# EAGLE schematic spi1.1 (EAGLE 6.1)
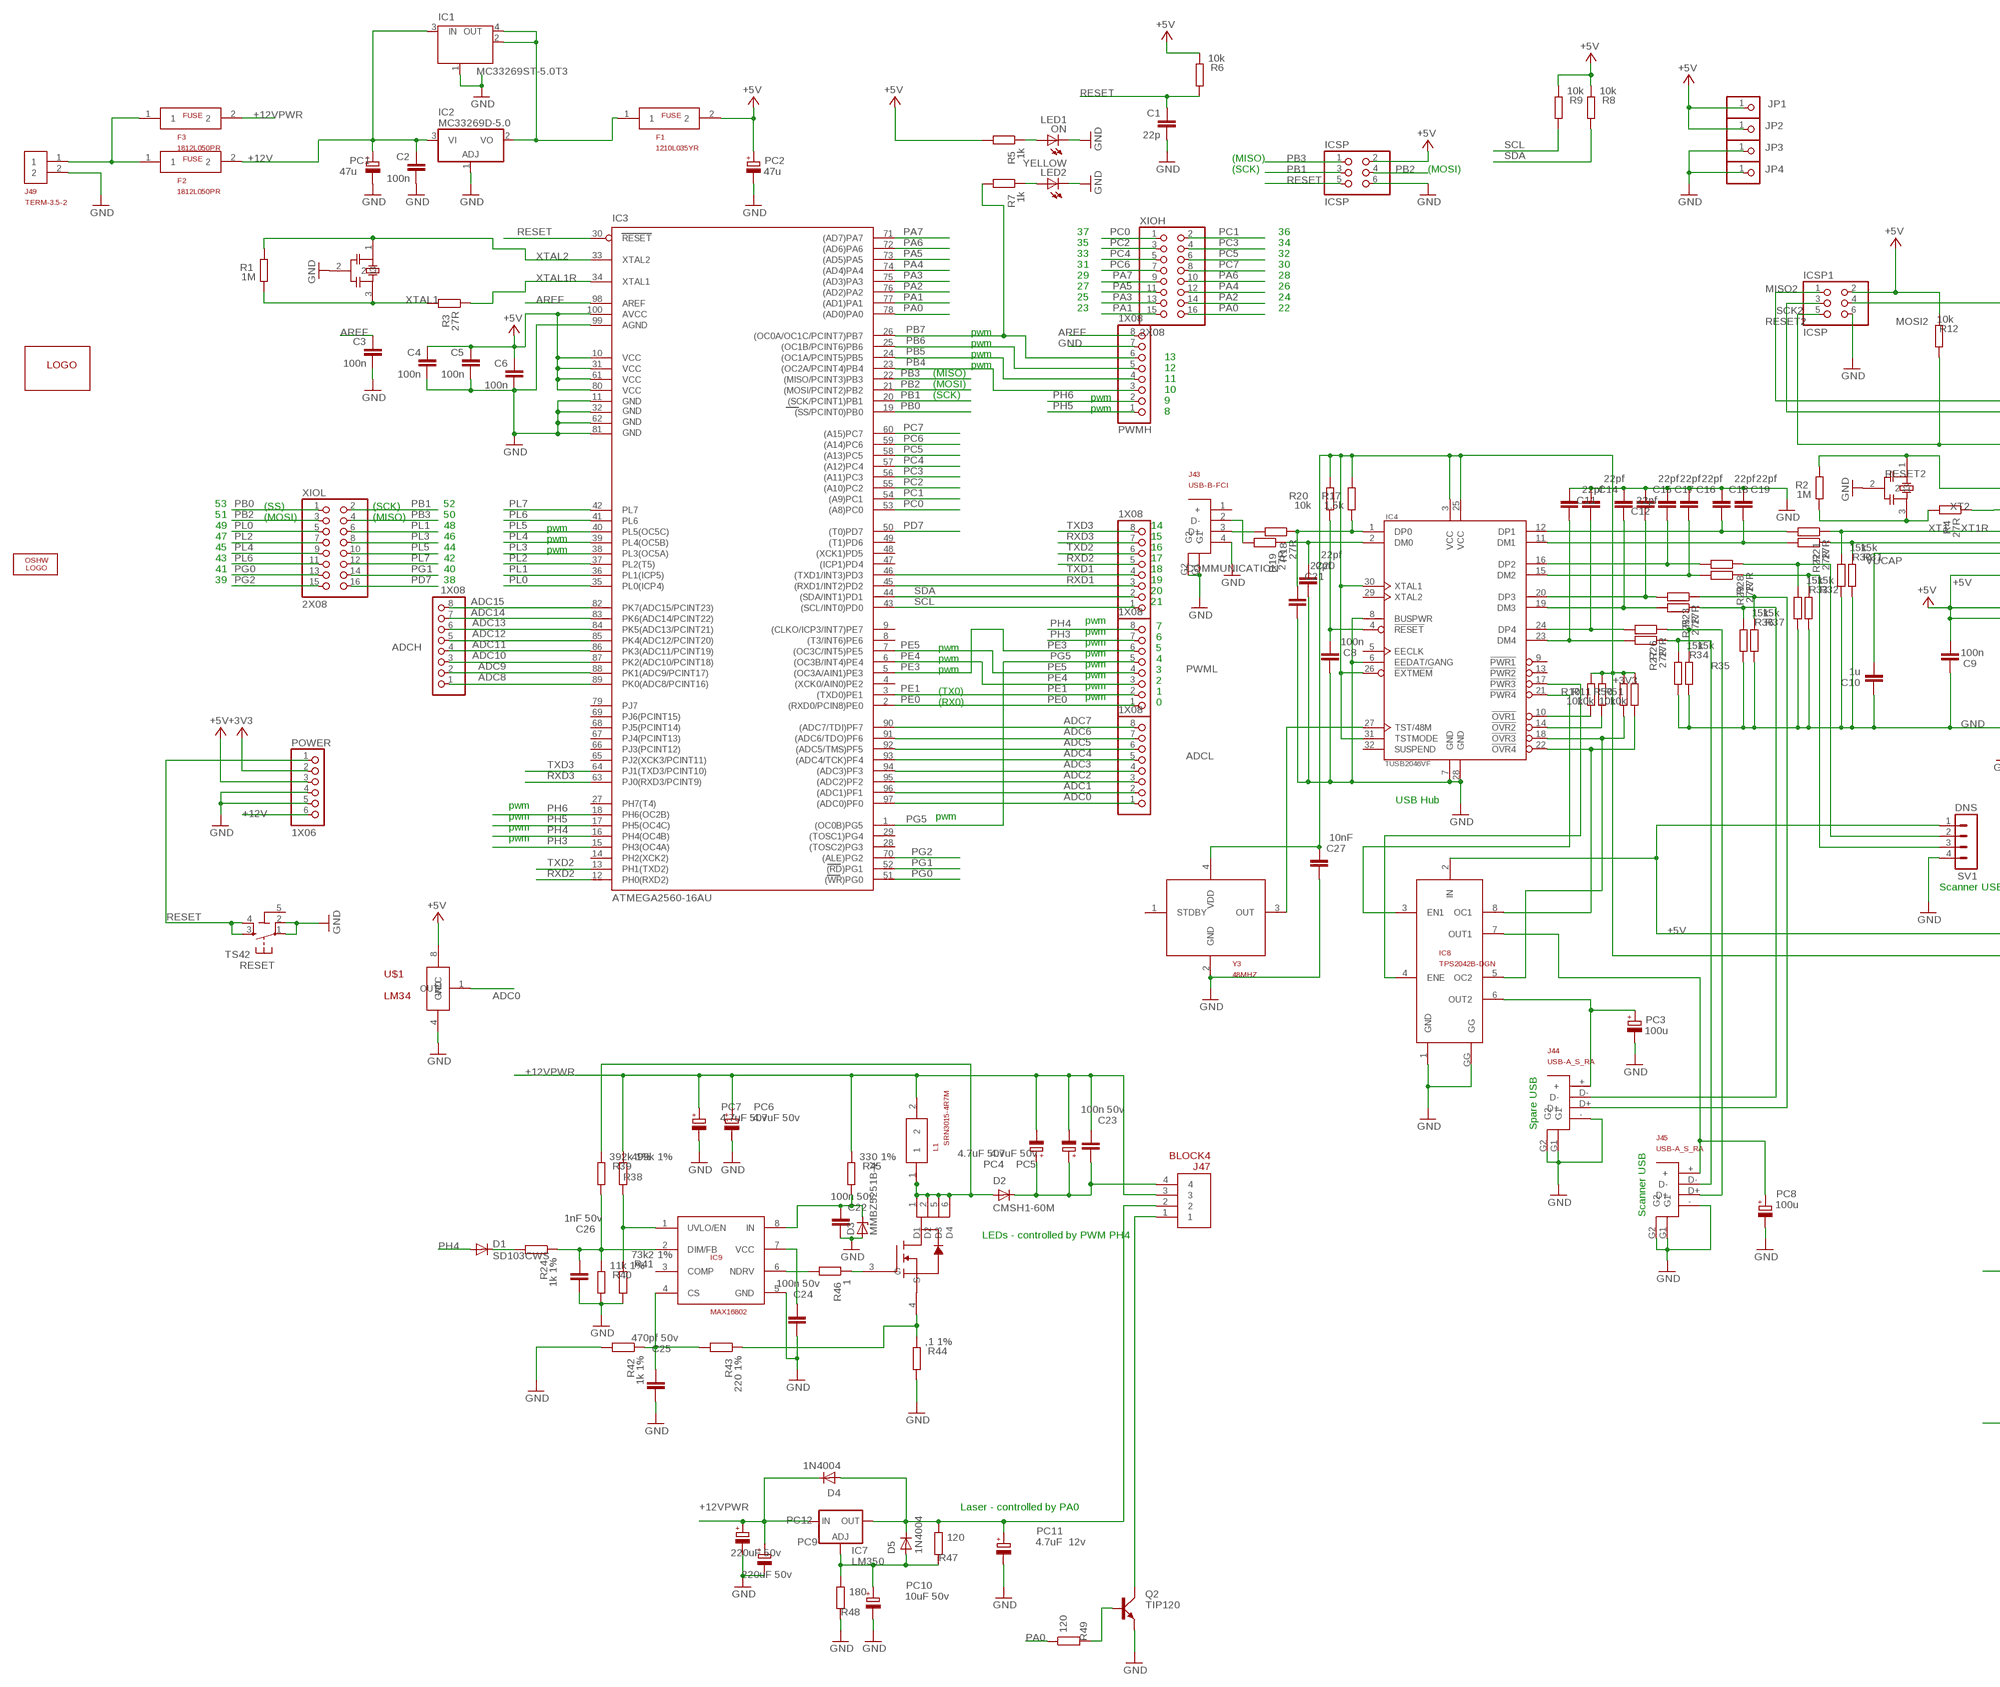
[diagram p0: schematic, sheet 1, part 1 of 2]
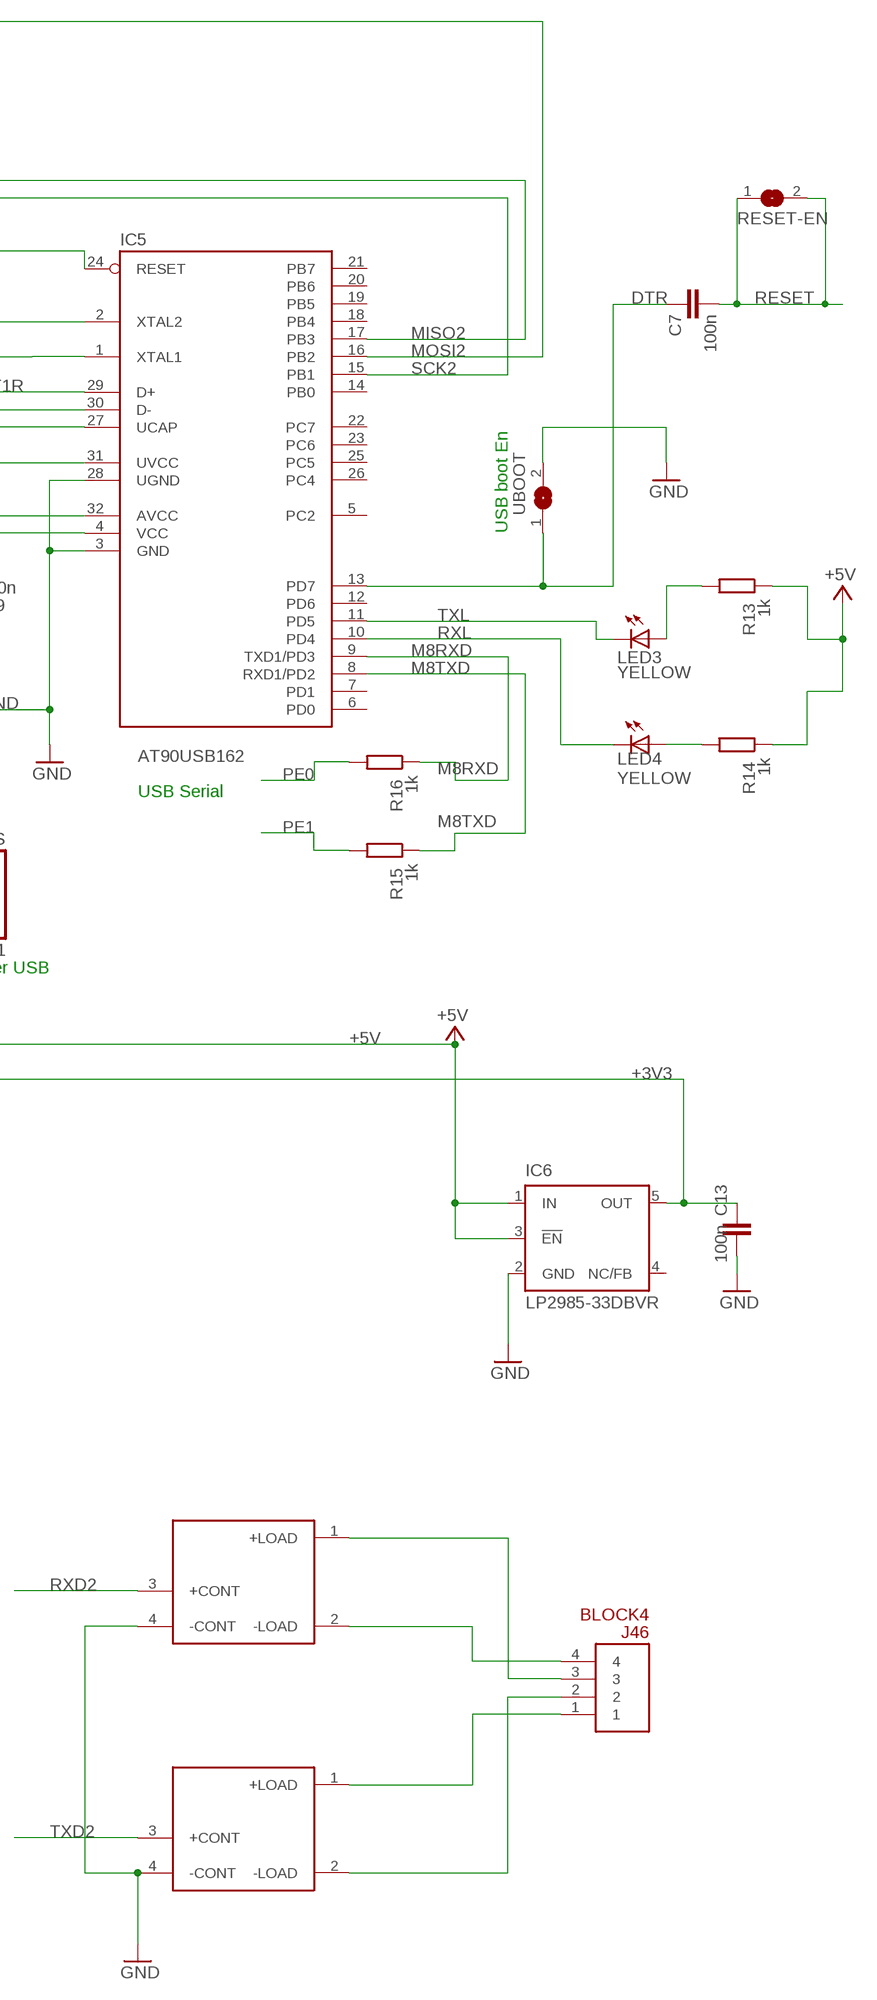
[diagram p1: schematic, sheet 1, part 2 of 2]

## Parts
ADCH  1X08  PINHD-1X8  [1X08]
ADCL  1X08  PINHD-1X8  [1X08]
C1  22p  C-EU0603-RND  [C0603-ROUND]
C2  100n  C-EU0603-RND  [C0603-ROUND]
C3  100n  C-EU0603-RND  [C0603-ROUND]
C4  100n  C-EU0603-RND  [C0603-ROUND]
C5  100n  C-EU0603-RND  [C0603-ROUND]
C6  100n  C-EU0603-RND  [C0603-ROUND]
C7  100n  C-EU0603-RND  [C0603-ROUND]
C8  100n  C-EU0603-RND  [C0603-ROUND]
C9  100n  C-EU0603-RND  [C0603-ROUND]
C10  1u  C-EU0603-RND  [C0603-ROUND]
C11  22pf  C-EU0603-RND  [C0603-ROUND]
C12  22pf  C-EU0603-RND  [C0603-ROUND]
C13  100n  C-EU0603-RND  [C0603-ROUND]
C14  22pf  C-EU0603-RND  [C0603-ROUND]
C15  22pf  C-EU0603-RND  [C0603-ROUND]
C16  22pf  C-EU0603-RND  [C0603-ROUND]
C17  22pf  C-EU0603-RND  [C0603-ROUND]
C18  22pf  C-EU0603-RND  [C0603-ROUND]
C19  22pf  C-EU0603-RND  [C0603-ROUND]
C20  22pf  C-EU0603-RND  [C0603-ROUND]
C21  22pf  C-EU0603-RND  [C0603-ROUND]
C22  100n 50v  C-EU0603-RND  [C0603-ROUND]
C23  100n 50v  C-EU0603-RND  [C0603-ROUND]
C24  100n 50v  C-EU0603-RND  [C0603-ROUND]
C25  470pf 50v  C-EU0603-RND  [C0603-ROUND]
C26  1nF 50v  C-EU0603-RND  [C0603-ROUND]
C27  10nF  C-EU0603-RND  [C0603-ROUND]
COMMUNICATION  1X08  PINHD-1X8  [1X08]
D1  SD103CWS  DIODE-SOD323-W  [SOD323-W]
D2  CMSH1-60M  GF1  [SMA-DO214AC]
D3  MMBZ5251B-V  ZENER-DIODESOT23  [SOT23]
D4  1N4004  GF1  [SMA-DO214AC]
D5  1N4004  GF1  [SMA-DO214AC]
F1  1210L035YR  [POLY6]
F2  1812L050PR  [POLY15]
F3  1812L050PR  [POLY15]
IC1  MC33269ST-5.0T3  MC33269ST-3.3T3  [SOT223]
IC2  MC33269D-5.0  [DPACK]
IC3  ATMEGA2560-16AU  ATMEGA1280-16AU  [TQFP100]
IC4  TUSB2046VF  [TQFP32-08]
IC5  AT90USB162  [TQFP32-08]
IC6  LP2985-33DBVR  TPS77033  [SOT23-DBV]
IC7  LM350  LM317TS  [317TS]
IC8  TPS2042B-DGN  [DGN-8]
IC9  MAX16802  MAX1602B  [USOP-8]
ICSP  ICSP  PINHD-2X3  [2X03]
ICSP1  ICSP  PINHD-2X3  [2X03]
J43  USB-B-FCI  [USB-B]
J44  USB-A_S_RA  [USB-A]
J45  USB-A_S_RA  [USB-A]
J46  BLOCK4  [TERM3.5-4]
J47  BLOCK4  [TERM3.5-4]
J49  TERM-3.5-2  [TERM3.5-2]
JP1  PINHD-1X1  [1X01]
JP2  PINHD-1X1  [1X01]
JP3  PINHD-1X1  [1X01]
JP4  PINHD-1X1  [1X01]
L1  SRN3015-4R7M  INDUCT1  [INDUCT1]
LED2  YELLOW  LEDCHIP-LED0805  [CHIP-LED0805]
LED3  YELLOW  LEDCHIP-LED0805  [CHIP-LED0805]
LED4  YELLOW  LEDCHIP-LED0805  [CHIP-LED0805]
LOGO2  OSHW_LOGO_FILLX0350-NT  [OSHW_FILLX350_NOTEXT]
ON  LED1  LEDCHIP-LED0805  [CHIP-LED0805]
PC1  47u  CPOL-EUUD-6,3X7,7  [UD-6,3X7,7_NICHICON]
PC2  47u  CPOL-EUUD-6,3X7,7  [UD-6,3X7,7_NICHICON]
PC3  100u  CPOL-EUUD-6,3X7,7  [UD-6,3X7,7_NICHICON]
PC4  4.7uF 50v  CPOL-EUC  [PANASONIC_C]
PC5  4.7uF 50v  CPOL-EUC  [PANASONIC_C]
PC6  4.7uF 50v  CPOL-EUC  [PANASONIC_C]
PC7  4.7uF 50v  CPOL-EUC  [PANASONIC_C]
PC8  100u  CPOL-EUUD-6,3X7,7  [UD-6,3X7,7_NICHICON]
PC9  220uF 50v  CPOL-EUG  [PANASONIC_G]
PC10  10uF 50v  CPOL-EUD  [PANASONIC_D]
PC11  4.7uF 12v  CPOL-EUC  [PANASONIC_C]
PC12  220uF 50v  CPOL-EUG  [PANASONIC_G]
POWER  1X06  PINHD-1X6  [1X06]
PWMH  1X08  PINHD-1X8  [1X08]
PWML  1X08  PINHD-1X8  [1X08]
Q2  TIP120  TIP41C  [TO220AV]
R1  1M  R-EU_R0603  [R0603-ROUND]
R2  1M  R-EU_R0603  [R0603-ROUND]
R3  27R  R-EU_R0603  [R0603-ROUND]
R4  27R  R-EU_R0603  [R0603-ROUND]
R5  1k  R-EU_R0603  [R0603-ROUND]
R6  10k  R-EU_R0603  [R0603-ROUND]
R7  1k  R-EU_R0603  [R0603-ROUND]
R8  10k  R-EU_R0603  [R0603-ROUND]
R9  10k  R-EU_R0603  [R0603-ROUND]
R10  10k  R-EU_R0603  [R0603-ROUND]
R11  10k  R-EU_R0603  [R0603-ROUND]
R12  10k  R-EU_R0603  [R0603-ROUND]
R13  1k  R-EU_R0603  [R0603-ROUND]
R14  1k  R-EU_R0603  [R0603-ROUND]
R15  1k  R-EU_R0603  [R0603-ROUND]
R16  1k  R-EU_R0603  [R0603-ROUND]
R17  1.5k  R-EU_R0603  [R0603-ROUND]
R18  27R  R-EU_R0603  [R0603-ROUND]
R19  27R  R-EU_R0603  [R0603-ROUND]
R20  10k  R-EU_R0603  [R0603-ROUND]
R21  27R  R-EU_R0603  [R0603-ROUND]
R22  27R  R-EU_R0603  [R0603-ROUND]
R23  27R  R-EU_R0603  [R0603-ROUND]
R24  1k 1%  R-EU_R0603  [R0603-ROUND]
R25  27R  R-EU_R0603  [R0603-ROUND]
R26  27R  R-EU_R0603  [R0603-ROUND]
R27  27R  R-EU_R0603  [R0603-ROUND]
R28  27R  R-EU_R0603  [R0603-ROUND]
R29  27R  R-EU_R0603  [R0603-ROUND]
R30  15k  R-EU_R0603  [R0603-ROUND]
R31  15k  R-EU_R0603  [R0603-ROUND]
R32  15k  R-EU_R0603  [R0603-ROUND]
R33  15k  R-EU_R0603  [R0603-ROUND]
R34  15k  R-EU_R0603  [R0603-ROUND]
R35  15k  R-EU_R0603  [R0603-ROUND]
R36  15k  R-EU_R0603  [R0603-ROUND]
R37  15k  R-EU_R0603  [R0603-ROUND]
R38  499k 1%  R-EU_R0603  [R0603-ROUND]
R39  392k 1%  R-EU_R0603  [R0603-ROUND]
R40  11k 1%  R-EU_R0603  [R0603-ROUND]
R41  73k2 1%  R-EU_R0603  [R0603-ROUND]
R42  1k 1%  R-EU_R0603  [R0603-ROUND]
R43  220 1%  R-EU_R0603  [R0603-ROUND]
R44  ,1 1%  R-EU_R1206  [R1206]
R45  330 1%  R-EU_R1206  [R1206]
R46  1  R-EU_R0603  [R0603-ROUND]
R47  120  R-EU_R0603  [R0603-ROUND]
R48  180  R-EU_R0603  [R0603-ROUND]
R49  120  R-EU_R0603  [R0603-ROUND]
R50  10k  R-EU_R0603  [R0603-ROUND]
R51  10k  R-EU_R0603  [R0603-ROUND]
RELAY1  XRELAY  [XRELAY]
RELAY2  XRELAY  [XRELAY]
RESET  TS42  [TS42]
RESET-EN  SJ  [SJ]
SV1  DNS  MA04-1  [MA04-1]
U$1  LM34  [SS08]
U$6  SI3458DVB  [TSOP6]
U$15  LOGO  [LOGO]
UBOOT  SJ  [SJ]
XIOH  2X08  PINHD-2X8  [2X08]
XIOL  2X08  PINHD-2X8  [2X08]
Y1  AWSCR  [RESONATOR1]
Y2  AWSCR  [RESONATOR1]
Y3  48MHZ  XTAL1  [XTAL1]

## Nets
+3V3: C13.2 C27.1 IC4.3(VCC) IC4.25(VCC) IC4.26(!EXTMEM) IC4.30(XTAL1) IC4.31(TSTMODE) IC6.5(OUT) POWER.2 R10.2 R11.2 R17.2 R20.2 R50.2 R51.2 Y3.4(VDD)
+5V: C4.1 C5.1 C6.1 C9.1 F1.2 IC3.10(VCC) IC3.31(VCC1) IC3.61(VCC2) IC3.80(VCC3) IC3.100(AVCC) IC5.4(VCC) IC5.31(UVCC) IC5.32(AVCC) IC6.1(IN) IC6.3(!EN) IC8.2(IN) ICSP1.2 ICSP.2 JP1.1 JP2.1 PC2.+ POWER.3 R5.2 R6.1 R8.1 R9.1 R12.1 R13.1 R14.1 SV1.1 U$1.8(VCC)
+12V: C2.1 F2.2 IC1.3(IN) IC2.3(VI) PC1.+ POWER.6
+12VPWR: C23.1 D4.K(C) F3.2 IC7.3(IN) J47.3 L1.2 PC4.- PC5.- PC6.+ PC7.+ PC9.+ PC12.+ R38.1 R45.1
ADC0: ADCL.1 IC3.97((ADC0)PF0) U$1.1(OUT)
ADC1: ADCL.2 IC3.96((ADC1)PF1)
ADC2: ADCL.3 IC3.95((ADC2)PF2)
ADC3: ADCL.4 IC3.94((ADC3)PF3)
ADC4: ADCL.5 IC3.93((ADC4/TCK)PF4)
ADC5: ADCL.6 IC3.92((ADC5/TMS)PF5)
ADC6: ADCL.7 IC3.91((ADC6/TDO)PF6)
ADC7: ADCL.8 IC3.90((ADC7/TDI)PF7)
ADC8: ADCH.1 IC3.89(PK0(ADC8/PCINT16))
ADC9: ADCH.2 IC3.88(PK1(ADC9/PCINT17))
ADC10: ADCH.3 IC3.87(PK2(ADC10/PCINT18))
ADC11: ADCH.4 IC3.86(PK3(ADC11/PCINT19))
ADC12: ADCH.5 IC3.85(PK4(ADC12/PCINT20))
ADC13: ADCH.6 IC3.84(PK5(ADC13/PCINT21))
ADC14: ADCH.7 IC3.83(PK6(ADC14/PCINT22))
ADC15: ADCH.8 IC3.82(PK7(ADC15/PCINT23))
AREF: C3.1 IC3.98(AREF) PWMH.8
DTR: C7.1 IC5.13(PD7) UBOOT.1
GND: C1.2 C2.2 C3.2 C4.2 C5.2 C6.2 C8.2 C9.2 C10.2 C11.1 C12.1 C13.1 C14.1 C15.1 C16.1 C17.1 C18.1 C19.1 C20.2 C21.2 C22.2 C24.2 C25.2 C26.2 C27.2 D3.1(A) IC1.1(GND/ADJ) IC2.1(ADJ) IC3.11(GND) IC3.32(GND1) IC3.62(GND2) IC3.81(GND3) IC3.99(AGND) IC4.6(EEDAT/GANG) IC4.7(GND) IC4.8(BUSPWR) IC4.28(GND) IC5.3(GND) IC5.28(UGND) IC6.2(GND) IC8.1(GND) IC8.GG IC9.5(GND) ICSP1.6 ICSP.6 J43.4(-) J43.G1 J43.G2 J44.- J44.G1 J44.G2 J45.- J45.G1 J45.G2 J49.2 JP3.1 JP4.1 LED2.C ON.C PC1.- PC2.- PC3.- PC6.- PC7.- PC8.- PC9.- PC10.- PC11.- PC12.- POWER.4 POWER.5 PWMH.7 Q2.E R30.2 R31.2 R32.2 R33.2 R34.2 R35.2 R36.2 R37.2 R40.2 R41.2 R42.2 R44.2 R48.2 RELAY1.4(-CONT) RELAY2.4(-CONT) RESET.1 RESET.2 SV1.4 U$1.4(GND) UBOOT.2 Y1.2 Y2.2 Y3.2(GND)
M8RXD: IC5.9(TXD1/PD3) R16.1
M8TXD: IC5.8(RXD1/PD2) R15.1
MISO2: IC5.17(PB3) ICSP1.1
MOSI2: IC5.16(PB2) ICSP1.4
N$1: J44.D+ R23.1 R37.1
N$2: LED2.A R7.1
N$3: ON.A R5.1
N$4: R28.1 R33.1 SV1.2
N$5: R29.1 R32.1 SV1.3
N$6: IC4.10(!OVR1) R10.1
N$7: IC4.14(!OVR2) R11.1
N$8: IC4.17(!PWR3) IC8.4(ENE)
N$9: C21.1 IC4.1(DP0) R17.1 R18.1
N$10: J45.D+ R26.1 R35.1
N$11: C8.1 IC4.4(!RESET) R20.1
N$12: IC4.21(!PWR4) IC8.3(EN1)
N$13: IC4.18(!OVR3) IC8.5(OC2) R50.1
N$14: IC4.22(!OVR4) IC8.8(OC1) R51.1
N$15: IC8.6(OUT2) J44.+ PC3.+
N$16: IC8.7(OUT1) J45.+ PC8.+
N$17: C15.2 IC4.20(DP3) R23.2
N$18: C17.2 IC4.16(DP2) R28.2
N$19: C16.2 IC4.15(DM2) R29.2
N$20: C12.2 IC4.19(DM3) R25.2
N$21: C14.2 IC4.24(DP4) R26.2
N$22: C11.2 IC4.23(DM4) R27.2
N$23: C18.2 IC4.12(DP1) R21.2
N$24: C19.2 IC4.11(DM1) R22.2
N$25: IC5.30(D-) R22.1 R31.1
N$26: IC5.29(D+) R21.1 R30.1
N$27: C20.1 IC4.2(DM0) R19.1
N$28: J44.D- R25.1 R36.1
N$29: D1.C R24.2
N$30: C26.1 IC9.2(DIM/FB) R24.1 R39.2 R40.1
N$31: J45.D- R27.1 R34.1
N$32: IC9.1(UVLO/EN) R38.2 R41.1
N$33: C23.2 D2.K(C) J47.4 PC4.+ PC5.+
N$34: IC4.27(TST/48M) Y3.3(OUT)
N$35: D2.A L1.1 R39.1 U$6.1(D1) U$6.2(D2) U$6.5(D3) U$6.6(D4)
N$36: C24.1 IC9.7(VCC)
N$37: F1.1 IC1.2(OUT) IC1.4(OUT) IC2.2(VO)
N$38: C25.1 IC9.4(CS) R42.1 R43.2
N$39: D5.A IC7.1(ADJ) PC10.+ R47.2 R48.1
N$40: C22.1 D3.3(C) IC9.8(IN) R45.2
N$41: R43.1 R44.1 U$6.4(S)
N$42: F2.1 F3.1 J49.1
N$43: IC9.6(NDRV) R46.2
N$44: R46.1 U$6.3(G)
N$45: J43.2(D-) R19.2
N$46: J43.3(D+) R18.2
N$47: D4.A D5.K(C) IC7.2(OUT) J47.2 PC11.+ R47.1
N$48: J47.1 Q2.C
N$49: J46.4 RELAY1.2(-LOAD)
N$50: J46.1 RELAY2.1(+LOAD)
N$51: J46.3 RELAY1.1(+LOAD)
N$52: Q2.B R49.2
N$53: J46.2 RELAY2.2(-LOAD)
N$54: LED4.A R14.2
N$55: LED3.A R13.2
PA0: IC3.78((AD0)PA0) R49.1 XIOH.16
PA1: IC3.77((AD1)PA1) XIOH.15
PA2: IC3.76((AD2)PA2) XIOH.14
PA3: IC3.75((AD3)PA3) XIOH.13
PA4: IC3.74((AD4)PA4) XIOH.12
PA5: IC3.73((AD5)PA5) XIOH.11
PA6: IC3.72((AD6)PA6) XIOH.10
PA7: IC3.71((AD7)PA7) XIOH.9
PB0: IC3.19((SS/PCINT0)PB0) XIOL.1
PB1: IC3.20((SCK/PCINT1)PB1) ICSP.3 XIOL.2
PB2: IC3.21((MOSI/PCINT2)PB2) ICSP.4 XIOL.3
PB3: IC3.22((MISO/PCINT3)PB3) ICSP.1 XIOL.4
PB4: IC3.23((OC2A/PCINT4)PB4) PWMH.3
PB5: IC3.24((OC1A/PCINT5)PB5) PWMH.4
PB6: IC3.25((OC1B/PCINT6)PB6) PWMH.5
PB7: IC3.26((OC0A/OC1C/PCINT7)PB7) PWMH.6 R7.2
PC0: IC3.53((A8)PC0) XIOH.1
PC1: IC3.54((A9)PC1) XIOH.2
PC2: IC3.55((A10)PC2) XIOH.3
PC3: IC3.56((A11)PC3) XIOH.4
PC4: IC3.57((A12)PC4) XIOH.5
PC5: IC3.58((A13)PC5) XIOH.6
PC6: IC3.59((A14)PC6) XIOH.7
PC7: IC3.60((A15)PC7) XIOH.8
PD7: IC3.50((T0)PD7) XIOL.16
PE0: IC3.2((RXD0/PCIN8)PE0) PWML.1 R16.2
PE1: IC3.3((TXD0)PE1) PWML.2 R15.2
PE3: IC3.5((OC3A/AIN1)PE3) PWML.6
PE4: IC3.6((OC3B/INT4)PE4) PWML.3
PE5: IC3.7((OC3C/INT5)PE5) PWML.4
PG0: IC3.51((WR)PG0) XIOL.13
PG1: IC3.52((RD)PG1) XIOL.14
PG2: IC3.70((ALE)PG2) XIOL.15
PG5: IC3.1((OC0B)PG5) PWML.5
PH3: IC3.15(PH3(OC4A)) PWML.7
PH4: D1.A IC3.16(PH4(OC4B)) PWML.8
PH5: IC3.17(PH5(OC4C)) PWMH.1
PH6: IC3.18(PH6(OC2B)) PWMH.2
PL0: IC3.35(PL0(ICP4)) XIOL.5
PL1: IC3.36(PL1(ICP5)) XIOL.6
PL2: IC3.37(PL2(T5)) XIOL.7
PL3: IC3.38(PL3(OC5A)) XIOL.8
PL4: IC3.39(PL4(OC5B)) XIOL.9
PL5: IC3.40(PL5(OC5C)) XIOL.10
PL6: IC3.41(PL6) XIOL.11
PL7: IC3.42(PL7) XIOL.12
RESET: C1.1 C7.2 IC3.30(RESET) ICSP.5 POWER.1 R6.2 RESET-EN.1 RESET-EN.2 RESET.3 RESET.4
RESET2: IC5.24(RESET) ICSP1.5 R12.2
RXD1: COMMUNICATION.3 IC3.45((RXD1/INT2)PD2)
RXD2: COMMUNICATION.5 IC3.12(PH0(RXD2)) RELAY1.3(+CONT)
RXD3: COMMUNICATION.7 IC3.63(PJ0(RXD3/PCINT9))
RXL: IC5.10(PD4) LED4.C
SCK2: IC5.15(PB1) ICSP1.3
SCL: COMMUNICATION.1 IC3.43((SCL/INT0)PD0) R9.2
SDA: COMMUNICATION.2 IC3.44((SDA/INT1)PD1) R8.2
TXD1: COMMUNICATION.4 IC3.46((TXD1/INT3)PD3)
TXD2: COMMUNICATION.6 IC3.13(PH1(TXD2)) RELAY2.3(+CONT)
TXD3: COMMUNICATION.8 IC3.64(PJ1(TXD3/PCINT10))
TXL: IC5.11(PD5) LED3.C
VUCAP: C10.1 IC5.27(UCAP)
XT1: R2.1 R4.2 Y2.3
XT1R: IC5.1(XTAL1) R4.1
XT2: IC5.2(XTAL2) R2.2 Y2.1
XTAL1: R1.1 R3.2 Y1.3
XTAL1R: IC3.34(XTAL1) R3.1
XTAL2: IC3.33(XTAL2) R1.2 Y1.1
Unconnected: IC3.4((XCK0/AIN0)PE2) IC3.8((T3/INT6)PE6) IC3.9((CLKO/ICP3/INT7)PE7) IC3.14(PH2(XCK2)) IC3.27(PH7(T4)) IC3.28((TOSC2)PG3) IC3.29((TOSC1)PG4) IC3.47((ICP1)PD4) IC3.48((XCK1)PD5) IC3.49((T1)PD6) IC3.65(PJ2(XCK3/PCINT11)) IC3.66(PJ3(PCINT12)) IC3.67(PJ4(PCINT13)) IC3.68(PJ5(PCINT14)) IC3.69(PJ6(PCINT15)) IC3.79(PJ7) IC4.5(EECLK) IC4.9(!PWR1) IC4.13(!PWR2) IC4.29(XTAL2) IC4.32(SUSPEND) IC5.5(PC2) IC5.6(PD0) IC5.7(PD1) IC5.12(PD6) IC5.14(PB0) IC5.18(PB4) IC5.19(PB5) IC5.20(PB6) IC5.21(PB7) IC5.22(PC7) IC5.23(PC6) IC5.25(PC5) IC5.26(PC4) IC6.4(NC/FB) IC9.3(COMP) J43.1(+) Y3.1(STDBY)

## Notes on the sheet
- (MISO)
- (SCK) | (MOSI)
- 37 | 36
- 35 | 34
- 33 | 32
- 31 | 30
- 29 | 28
- 27 | 26
- 25 | 24
- 23 | 22
- pwm
- pwm
- pwm | 13
- pwm | 12
- (MISO)
- 11
- (MOSI)
- 10
- (SCK) | pwm
- 9
- pwm | 8
- 53 | (SS) | (SCK) | 52
- 51 | (MOSI) | (MISO) | 50
- 49 | 48 | pwm | 14
- 47 | 46 | pwm | 15
- 45 | 44 | pwm | 16
- 43 | 42 | 17
- 41 | 40 | 18
- 39 | 38 | 19
- 20
- 21
- USB boot En
- pwm
- 7
- pwm
- 6
- pwm
- pwm | 5
- pwm
- pwm | 4
- pwm
- pwm | 3
- pwm
- 2
- pwm
- (TX0) | 1
- pwm
- (RX0) | 0
- USB Serial
- USB Hub
- pwm
- pwm | pwm
- pwm
- pwm
- Scanner USB
- Spare USB
- Scanner USB
- LEDs - controlled by PWM PH4
- Laser - controlled by PA0

## Power pins joined to a net without a drawn wire
5-GND: RESET.5(5-GND)

## Library data of the parts
ADCH ADCL COMMUNICATION PWMH PWML = pinhead:PINHD-1X8: PIN HEADER
C1-C27 = SmartPrj:C-EU: CAPACITOR, European symbol
D1 = diode:DIODE-: DIODE
D2 D4 D5 = diode:GF1: DIODE
D3 = diode:ZENER-DIODE: Z-Diode
F1 = usb:1210L035YR
F2 F3 = usb:1812L050PR
IC1 = linear:MC33269ST*: Adjustable Output Low Dropout Voltage Regulator 800 mA Source: http://www.onsemi.com/pub/Collateral/MC33269-D.PDF
IC2 = linear:MC33269?*: Adjustable Output Low Dropout Voltage Regulator 800 mA Source: http://www.onsemi.com/pub/Collateral/MC33269-D.PDF
IC3 = atmel-2005:ATMEGA*: MICROCONTROLLER 64/128/256 Kbytes FLASH 4 Kbytes EEPROM 8 Kbytes SRAM 86 General Purpose I/O pins 12-channels16-bit PWM 4 x Serial USARTs 16-channels 10-bit A/D
IC4 = jt-texas:TUSB2046: 4-port full speed USB hub (USB1.1)
IC5 = atmelnew:AT90USB162
IC6 = texas:TPS770*: ULTRALOW-POWER 50-mA LOW-DROPOUT LINEAR REGULATORS 50-mA Low-Dropout Regulator Source: http://focus.ti.com/lit/ds/symlink/tps77001.pdf; MF: TEXAS INSTRUMENTS; MPN: TPS77033DBVT; OC_FARNELL: 8461570; OC_NEWARK: 77C1187
IC7 = v-reg:LM317TS: VOLTAGE REGULATOR
IC8 = usb:TPS2042B-DGN
IC9 = usb:MAX1602B
ICSP ICSP1 = pinhead:PINHD-2X3: PIN HEADER
J43 = usb:USB-B-FCI
J44 J45 = usb:USB-A_S_RA
J46 J47 = usb:BLOCK4
J49 = usb:TERM-3.5-2
JP1-JP4 = pinhead:PINHD-1X1: PIN HEADER
L1 = usb:INDUCT1
LED2-LED4 ON = led:LED: LED OSRAM: - CHIPLED LG R971, LG N971, LY N971, LG Q971, LY Q971, LO R971, LY R971 LH N974, LH R974 LS Q976, LO Q976, LY Q976 LO Q996 - Hyper CHIPLED LW Q18S LB Q993, LB Q99A, LB R99A - SideLED LS A670, LO A670, LY A670, LG A670, LP A670 LB A673, LV A673, LT A673, LW A673 LH A674 LY A675 LS A676, LA A676, LO A676, LY A676, LW A676 LS A679, LY A679, LG A679 - Hyper Micro SIDELED® LS Y876, LA Y876, LO Y876, LY Y876 LT Y87S - SmartLED LW L88C, LW L88S LB L89C, LB L89S, LG L890 LS L89K, LO L89K, LY L89K LS L896, LA L896, LO L896, LY L896 - TOPLED LS T670, LO T670, LY T670, LG T670, LP T670 LSG T670, LSP T670, LSY T670, LOP T670, LYG T670 LG T671, LOG T671, LSG T671 LB T673, LV T673, LT T673, LW T673 LH T674 LS T676, LA T676, LO T676, LY T676, LB T676, LH T676, LSB T676, LW T676 LB T67C, LV T67C, LT T67C, LS T67K, LO T67K, LY T67K, LW E67C LS E67B, LA E67B, LO E67B, LY E67B, LB E67C, LV E67C, LT E67C LW T67C LS T679, LY T679, LG T679 LS T770, LO T770, LY T770, LG T770, LP T770 LB T773, LV T773, LT T773, LW T773 LH T774 LS E675, LA E675, LY E675, LS T675 LS T776, LA T776, LO T776, LY T776, LB T776 LHGB T686 LT T68C, LB T68C - Hyper Mini TOPLED® LB M676 - Mini TOPLED Santana® LG M470 LS M47K, LO M47K, LY M47K Source: http://www.osram.convergy.de LUXEON: - LUMILED® LXK2-PW12-R00, LXK2-PW12-S00, LXK2-PW14-U00, LXK2-PW14-V00 LXK2-PM12-R00, LXK2-PM12-S00, LXK2-PM14-U00 LXK2-PE12-Q00, LXK2-PE12-R00, LXK2-PE12-S00, LXK2-PE14-T00, LXK2-PE14-U00 LXK2-PB12-K00, LXK2-PB12-L00, LXK2-PB12-M00, LXK2-PB14-N00, LXK2-PB14-P00, LXK2-PB14-Q00 LXK2-PR12-L00, LXK2-PR12-M00, LXK2-PR14-Q00, LXK2-PR14-R00 LXK2-PD12-Q00, LXK2-PD12-R00, LXK2-PD12-S00 LXK2-PH12-R00, LXK2-PH12-S00 LXK2-PL12-P00, LXK2-PL12-Q00, LXK2-PL12-R00 Source: www.luxeon.com KINGBRIGHT: KA-3528ASYC Source: www.kingbright.com
LOGO2 = ohw-logo:OSHW_LOGO_FILL
PC1-PC12 = rcl:CPOL-EU: POLARIZED CAPACITOR, European symbol
POWER = pinhead:PINHD-1X6: PIN HEADER
Q2 = transistor-power:TIP41C: NPN TRANSISTOR
R1-R51 = SmartPrj:R-EU_: RESISTOR, European symbol
RELAY1 RELAY2 = usb:XRELAY
RESET = st-mod v1.4:TS42: TS42 Dongnan Electronics Tact switch VDC 12V - 50mA
RESET-EN UBOOT = jumper:SJ: SMD solder JUMPER
SV1 = con-lstb:MA04-1: PIN HEADER; OC_FARNELL: unknown; OC_NEWARK: unknown
U$1 = usb:LM34
U$6 = usb:SI3458DVB
U$15 = dspace:LOGO
XIOH XIOL = pinhead:PINHD-2X8: PIN HEADER
Y1 Y2 = usb:AWSCR
Y3 = usb:XTAL1

## Net classes
0 default: width 0.152 mm, drill 0.305 mm, clearance 0.152 mm